# Altium schematic sheet ocelot-pro_schematic.schdoc
size 441 x 193 mm
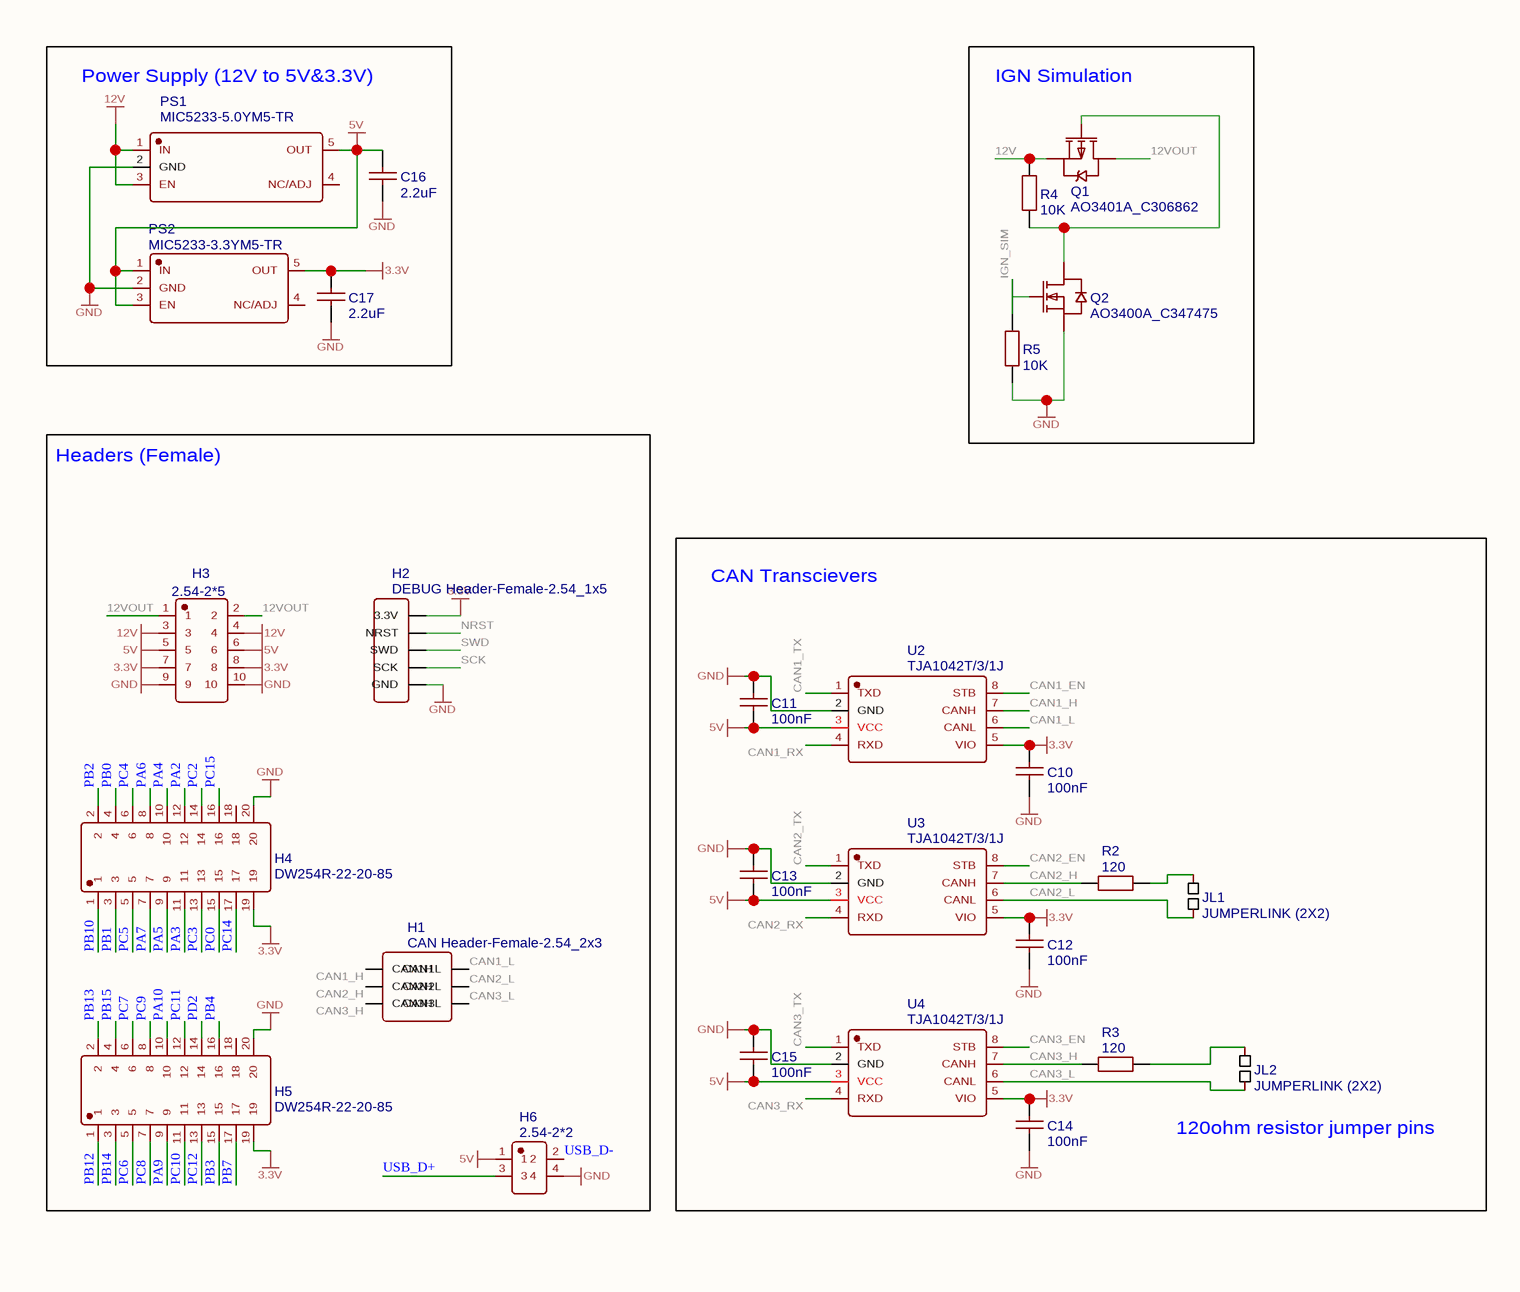
[diagram p0: ocelot-pro_schematic.schdoc, left]
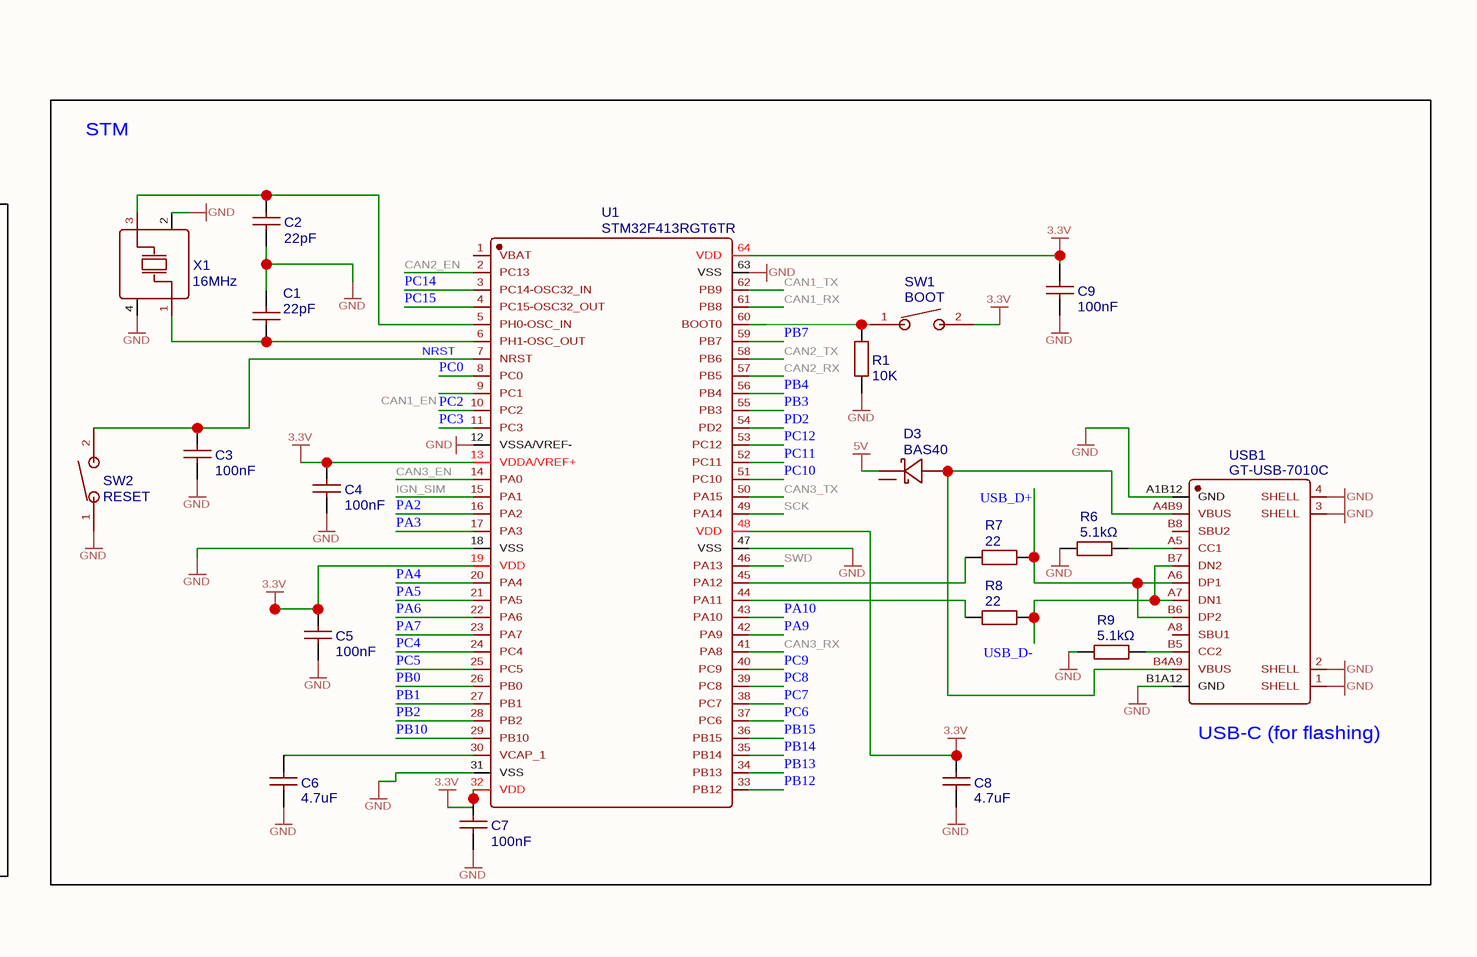
[diagram p1: ocelot-pro_schematic.schdoc, right]

## Parts
C1  22pF  [C0603]
C2  22pF  [C0603]
C3  100nF  [C0603]
C4  100nF  [C0603]
C5  100nF  [C0603]
C6  4.7uF  [C0603]
C7  100nF  [C0603]
C8  4.7uF  [C0603]
C9  100nF  [C0603]
C10  100nF  [C0603]
C11  100nF  [C0603]
C12  100nF  [C0603]
C13  100nF  [C0603]
C14  100nF  [C0603]
C15  100nF  [C0603]
C16  2.2uF  [C0603]
C17  2.2uF  [C0603]
D3  BAS40  [SOT-23-3_L2.9-W1.3-P1.90-LS2.4-BR]
H1  CAN Header-Female-2.54_2x3  [HDR-TH_6P-P2.54-V-F-R2-C3-S2.54]
H2  DEBUG Header-Female-2.54_1x5  [HDR-TH_5P-P2.54-V-F]
H3  2.54-2*5  [HDR-TH_10P-P2.54-V-F-R2-C5-S2.54]
H4  DW254R-22-20-85  [HDR-TH_20P-P2.54-V-F-R2-C10-S2.54]
H5  DW254R-22-20-85  [HDR-TH_20P-P2.54-V-F-R2-C10-S2.54]
H6  2.54-2*2  [HDR-TH_4P-P2.54-V-F-R2-C2-S2.54]
JL1  JUMPERLINK (2X2)  [JUMPERLINK 2X2]
JL2  JUMPERLINK (2X2)  [JUMPERLINK 2X2]
PS1  MIC5233-5.0YM5-TR  [SOT-23-5_L2.9-W1.6-P0.95-LS2.8-BL]
PS2  MIC5233-3.3YM5-TR  [SOT-23-5_L3.0-W1.7-P0.95-LS2.8-BL]
Q1  AO3401A_C306862  [SOT-23-3_L2.9-W1.3-P1.90-LS2.4-BR]
Q2  AO3400A_C347475  [SOT-23-3_L2.9-W1.3-P1.90-LS2.4-BR]
R1  10K  [R0603]
R2  120  [R0402]
R3  120  [R0402]
R4  10K  [R0603]
R5  10K  [R0603]
R6  5.1kΩ  [R0603]
R7  22  [R0603]
R8  22  [R0603]
R9  5.1kΩ  [R0603]
SW1  BOOT  [SW-SMD_L6.5-W3.6-LS8.0]
SW2  RESET  [SW-SMD_L6.5-W3.6-LS8.0]
U1  STM32F413RGT6TR  [LQFP-64_L10.0-W10.0-P0.50-LS12.0-BL]
U2  TJA1042T/3/1J  [SOIC-8_L5.0-W4.0-P1.27-LS6.0-BL]
U3  TJA1042T/3/1J  [SOIC-8_L5.0-W4.0-P1.27-LS6.0-BL]
U4  TJA1042T/3/1J  [SOIC-8_L5.0-W4.0-P1.27-LS6.0-BL]
USB1  GT-USB-7010C  [USB-C-SMD_GT-USB-7010C]
X1  16MHz  [OSC-SMD_4P-L3.2-W2.5-BL]

## Blocks framed on the sheet
Power Supply (12V to 5V&3.3V): C16 C17 PS1 PS2
IGN Simulation: Q1 Q2 R4 R5
Headers (Female): H1-H6

## Nets
3.3V: C4.2 C5.2 C7.2 C8.2 C9.2 C10.2 C12.2 C14.2 C17.2 H2.5(3.3V) H3.7 H3.8 H4.19 H5.19 PS2.5(OUT) SW1.2 U1.13(VDDA/VREF+) U1.19(VDD) U1.32(VDD) U1.48(VDD) U1.64(VDD) U2.5(VIO) U3.5(VIO) U4.5(VIO)
5V: C11.1 C13.1 C15.1 C16.2 D3.3(K) H3.5 H3.6 H6.1 PS1.5(OUT) PS2.1(IN) PS2.3(EN) U2.3(VCC) U3.3(VCC) U4.3(VCC)
12V: H3.3 H3.4 PS1.1(IN) PS1.3(EN) Q1.2(S) R4.2
GND: C1.1 C2.2 C3.1 C4.1 C5.1 C6.1 C7.1 C8.1 C9.1 C10.1 C11.2 C12.1 C13.2 C14.1 C15.2 C16.1 C17.1 H2.1(GND) H3.9 H3.10 H4.20 H5.20 H6.4 PS1.2(GND) PS2.2(GND) Q2.2(S) R1.1 R5.1 R6.2 R9.2 SW2.1 U1.12(VSSA/VREF-) U1.18(VSS) U1.31(VSS) U1.47(VSS) U1.63(VSS) U2.2(GND) U3.2(GND) U4.2(GND) USB1.1(SHELL) USB1.2(SHELL) USB1.3(SHELL) USB1.4(SHELL) USB1.A1B12(GND) USB1.B1A12(GND) X1.2(GND) X1.4(GND)
12VOUT: H3.1 H3.2 Q1.3(D)
CAN1_EN: U1.9(PC1) U2.8(STB)
CAN1_H: H1.1(CAN1H) U2.7(CANH)
CAN1_L: H1.2(CAN1L) U2.6(CANL)
CAN1_RX: U1.61(PB8) U2.4(RXD)
CAN1_TX: U1.62(PB9) U2.1(TXD)
CAN2_EN: U1.2(PC13) U3.8(STB)
CAN2_H: H1.3(CAN2H) R2.2 U3.7(CANH)
CAN2_L: H1.4(CAN2L) JL1.1 U3.6(CANL)
CAN2_RX: U1.57(PB5) U3.4(RXD)
CAN2_TX: U1.58(PB6) U3.1(TXD)
CAN3_EN: U1.14(PA0) U4.8(STB)
CAN3_H: H1.5(CAN3H) R3.2 U4.7(CANH)
CAN3_L: H1.6(CAN3L) JL2.1 U4.6(CANL)
CAN3_RX: U1.41(PA8) U4.4(RXD)
CAN3_TX: U1.50(PA15) U4.1(TXD)
IGN_SIM: Q2.1(G) R5.2 U1.15(PA1)
NRST: C3.2 H2.4(NRST) SW2.2 U1.7(NRST)
PA2: H4.12 U1.16(PA2)
PA3: H4.11 U1.17(PA3)
PA4: H4.10 U1.20(PA4)
PA5: H4.9 U1.21(PA5)
PA6: H4.8 U1.22(PA6)
PA7: H4.7 U1.23(PA7)
PA9: H5.9 U1.42(PA9)
PA10: H5.10 U1.43(PA10)
PB0: H4.4 U1.26(PB0)
PB1: H4.3 U1.27(PB1)
PB2: H4.2 U1.28(PB2)
PB3: H5.15 U1.55(PB3)
PB4: H5.16 U1.56(PB4)
PB7: H5.17 U1.59(PB7)
PB10: H4.1 U1.29(PB10)
PB12: H5.1 U1.33(PB12)
PB13: H5.2 U1.34(PB13)
PB14: H5.3 U1.35(PB14)
PB15: H5.4 U1.36(PB15)
PC0: H4.15 U1.8(PC0)
PC2: H4.14 U1.10(PC2)
PC3: H4.13 U1.11(PC3)
PC4: H4.6 U1.24(PC4)
PC5: H4.5 U1.25(PC5)
PC6: H5.5 U1.37(PC6)
PC7: H5.6 U1.38(PC7)
PC8: H5.7 U1.39(PC8)
PC9: H5.8 U1.40(PC9)
PC10: H5.11 U1.51(PC10)
PC11: H5.12 U1.52(PC11)
PC12: H5.13 U1.53(PC12)
PC14: H4.17 U1.3(PC14-OSC32_IN)
PC15: H4.16 U1.4(PC15-OSC32_OUT)
PD2: H5.14 U1.54(PD2)
SCK: H2.2(SCK) U1.49(PA14)
SWD: H2.3(SWD) U1.46(PA13)
USB_D+: H6.3 R7.1 USB1.A6(DP1) USB1.B6(DP2)
USB_D-: H6.2 R8.1 USB1.A7(DN1) USB1.B7(DN2)
NetC1_2: C1.2 U1.6(PH1-OSC_OUT) X1.1(OSC1)
NetC2_1: C2.1 U1.5(PH0-OSC_IN) X1.3(OSC2)
NetC6_2: C6.2 U1.30(VCAP_1)
NetD3_1: D3.1(A) USB1.A4B9(VBUS) USB1.B4A9(VBUS)
NetJL1_2: JL1.2 R2.1
NetJL2_2: JL2.2 R3.1
NetQ1_1: Q1.1(G) Q2.3(D) R4.1
NetR1_2: R1.2 SW1.1 U1.60(BOOT0)
NetR6_1: R6.1 USB1.A5(CC1)
NetR7_2: R7.2 U1.45(PA12)
NetR8_2: R8.2 U1.44(PA11)
NetR9_1: R9.1 USB1.B5(CC2)

Not connected (* = marked no-connect by the designer): D3 2(NC); H4 18; H5 18; PS1 4(NC/ADJ); PS2 4(NC/ADJ); U1 1(VBAT); USB1 A8(SBU1) B8(SBU2)

## Notes on the sheet
- STM
- CAN Transcievers
- (near JL2) 120ohm resistor jumper pins
- (near USB1) USB-C (for flashing)

## Library data of the parts
C1 C2 = 22pF: BOM_Manufacturer: YAGEO(国巨); BOM_Manufacturer Part: CC0603JRNPO9BN220; nameAlias: Capacitance; BOM_Supplier: LCSC; BOM_Supplier Part: C105620; BOM_JLCPCB Part Class: Extended Part; spicePre: C; spiceSymbolName: CC0603JRNPO9BN220
C3-C5 C7 C9-C15 = 100nF: BOM_Manufacturer: FH(风华); BOM_Manufacturer Part: 0603B104K500NT; nameAlias: Capacitance; BOM_Supplier: LCSC; BOM_Supplier Part: C30926; BOM_JLCPCB Part Class: Extended Part; spicePre: C; spiceSymbolName: 0603B104K500NT
C6 C8 = 4.7uF: BOM_Manufacturer Part: CL10A475KO8NNNC; BOM_Manufacturer: SAMSUNG(三星); nameAlias: Capacitance; BOM_Supplier: LCSC; BOM_Supplier Part: C19666; BOM_JLCPCB Part Class: Basic Part; spicePre: C; spiceSymbolName: CL10A475KO8NNNC
C16 C17 = 2.2uF: BOM_Manufacturer Part: CL10A225KO8NNNC; BOM_Manufacturer: SAMSUNG(三星); nameAlias: Capacitance; BOM_Supplier: LCSC; BOM_Supplier Part: C23630; BOM_JLCPCB Part Class: Basic Part; spicePre: C; spiceSymbolName: CL10A225KO8NNNC
D3 = BAS40: BOM_Manufacturer: YANGJIE(扬杰); Contributor: lcsc; BOM_Supplier: LCSC; BOM_Supplier Part: C968032; BOM_Manufacturer Part: BAS40; spicePre: D; spiceSymbolName: BAS40
H1 = CAN Header-Female-2.54_2x3: BOM_Manufacturer: CONNFLY; BOM_Manufacturer Part: DS1023-2*3SF11; Contributor: LCSC; BOM_Supplier: LCSC; BOM_Supplier Part: C92272; BOM_JLCPCB Part Class: Extended Part; spicePre: H; spiceSymbolName: Header-Female-2.54_2x3
H2 = DEBUG Header-Female-2.54_1x5: BOM_Manufacturer: BOOMELE(博穆精密); BOM_Manufacturer Part: 2.54-1*5P母; BOM_Supplier: LCSC; BOM_Supplier Part: C50950; BOM_JLCPCB Part Class: Extended Part; spicePre: H; spiceSymbolName: Header-Female-2.54_1x5
H3 = 2.54-2*5: BOM_Manufacturer: ZHOURI(洲日); Contributor: LCSC; BOM_Supplier: LCSC; BOM_Supplier Part: C2977587; BOM_Manufacturer Part: 2.54-2*5; link: https://atta.szlcsc.com/upload/public/pdf/source/20220328/53961E697C4FF664B69BABFADEC8B830.pdf; BOM_JLCPCB Part Class: Extended Part; spicePre: H; spiceSymbolName: 2.54-2*5
H4 H5 = DW254R-22-20-85: BOM_Manufacturer: DEALON(德艺隆); Contributor: LCSC; BOM_Supplier: LCSC; BOM_Supplier Part: C2935991; BOM_Manufacturer Part: DW254R-22-20-85; BOM_JLCPCB Part Class: Extended Part; spicePre: U; spiceSymbolName: DW254R-22-20-85
H6 = 2.54-2*2: BOM_Manufacturer: ZHOURI(洲日); Contributor: LCSC; BOM_Supplier: LCSC; BOM_Supplier Part: C2977590; BOM_Manufacturer Part: 2.54-2*2; link: https://atta.szlcsc.com/upload/public/pdf/source/20220328/0DEB63D734370D90CA736158671615A0.pdf; BOM_JLCPCB Part Class: Extended Part; spicePre: H; spiceSymbolName: 2.54-2*2
JL1 JL2 = JUMPERLINK (2X2): Contributor: PAJB007; spicePre: J; spiceSymbolName: JUMPERLINK (2X2)
PS1 = MIC5233-5.0YM5-TR: BOM_Manufacturer: MICROCHIP(美国微芯); Contributor: LCSC; BOM_Supplier: LCSC; BOM_Supplier Part: C219988; BOM_Manufacturer Part: MIC5233-5.0YM5-TR; BOM_JLCPCB Part Class: Extended Part; spicePre: U; spiceSymbolName: MIC5233-5.0YM5-TR
PS2 = MIC5233-3.3YM5-TR: BOM_Manufacturer: MICROCHIP(美国微芯); Contributor: LCSC; BOM_Supplier: LCSC; BOM_Manufacturer Part: MIC5233-3.3YM5-TR; BOM_Supplier Part: C150784; BOM_JLCPCB Part Class: Extended Part; spicePre: U; spiceSymbolName: MIC5233-3.3YM5-TR
Q1 = AO3401A_C306862: BOM_Manufacturer: BORN(伯恩半导体); Contributor: LCSC; BOM_Supplier: LCSC; BOM_Supplier Part: C306862; BOM_Manufacturer Part: AO3401A; BOM_JLCPCB Part Class: Extended Part; spicePre: Q; spiceSymbolName: AO3401A_C306862
Q2 = AO3400A_C347475: BOM_Manufacturer: UMW(广东友台半导体); Contributor: LCSC; BOM_Supplier: LCSC; BOM_Supplier Part: C347475; BOM_Manufacturer Part: AO3400A; BOM_JLCPCB Part Class: Extended Part; spicePre: Q; spiceSymbolName: AO3400A_C347475
R1 R4 R5 = 10K: BOM_Manufacturer: YAGEO(国巨); BOM_Manufacturer Part: RC0603FR-0710KL; nameAlias: Resistance (Ohms); Resistance: 10kΩ; BOM_Supplier: LCSC; BOM_Supplier Part: C98220; BOM_JLCPCB Part Class: Extended Part; spicePre: R; spiceSymbolName: RC0603FR-0710KL
R2 R3 = 120: BOM_Manufacturer: YAGEO(国巨); BOM_Manufacturer Part: RC0402FR-07120RL; nameAlias: Resistance (Ohms); Resistance: 120Ω; BOM_Supplier: LCSC; BOM_Supplier Part: C114758; BOM_JLCPCB Part Class: Extended Part; spicePre: R; spiceSymbolName: RC0402FR-07120RL
R6 R9 = 5.1kΩ: BOM_Manufacturer Part: 0603WAF5101T5E; BOM_Manufacturer: UNI-ROYAL(厚声); Resistance (Ohms): 5.1K; nameAlias: Resistance; BOM_Supplier: LCSC; BOM_Supplier Part: C23186; BOM_JLCPCB Part Class: Basic Part; spicePre: R; spiceSymbolName: 0603WAF5101T5E
R7 R8 = 22: BOM_Manufacturer: YAGEO(国巨); BOM_Manufacturer Part: RC0603JR-0722RL; nameAlias: Resistance (Ohms); Resistance: 22Ω; BOM_Supplier: LCSC; BOM_Supplier Part: C108405; BOM_JLCPCB Part Class: Extended Part; spicePre: R; spiceSymbolName: RC0603JR-0722RL
SW1 = BOOT: BOM_Manufacturer: BRIGHT(博瑞泰); BOM_Manufacturer Part: TSA363G25-250B; Contributor: LCSC; BOM_Supplier: LCSC; BOM_Supplier Part: C354943; BOM_JLCPCB Part Class: Extended Part; spicePre: S; spiceSymbolName: TSA363G25-250B
SW2 = RESET: BOM_Manufacturer: BRIGHT(博瑞泰); BOM_Manufacturer Part: TSA363G25-250B; Contributor: LCSC; BOM_Supplier: LCSC; BOM_Supplier Part: C354943; BOM_JLCPCB Part Class: Extended Part; spicePre: S; spiceSymbolName: TSA363G25-250B
U1 = STM32F413RGT6TR: BOM_Manufacturer: ST(意法半导体); Contributor: LCSC; BOM_Supplier: LCSC; BOM_Supplier Part: C1852726; BOM_Manufacturer Part: STM32F413RGT6TR; spicePre: U; spiceSymbolName: STM32F413RGT6TR
U2-U4 = TJA1042T/3/1J: BOM_Manufacturer: NXP(恩智浦); Contributor: LCSC; BOM_Supplier: LCSC; BOM_Supplier Part: C132227; BOM_Manufacturer Part: TJA1042T/3/1J; BOM_JLCPCB Part Class: Extended Part; spicePre: U; spiceSymbolName: TJA1042T/3/1J
USB1 = GT-USB-7010C: BOM_Manufacturer: G-Switch(品赞); Contributor: LCSC; BOM_Supplier: LCSC; BOM_Supplier Part: C2843967; BOM_Manufacturer Part: GT-USB-7010C; BOM_JLCPCB Part Class: Extended Part; spicePre: U; spiceSymbolName: GT-USB-7010C
X1 = 16MHz: BOM_Manufacturer: YXC(扬兴晶振); BOM_Manufacturer Part: X322516MLB4SI; nameAlias: Frequency; BOM_Supplier: LCSC; BOM_Supplier Part: C13738; BOM_JLCPCB Part Class: Basic Part; spicePre: X; spiceSymbolName: X322516MLB4SI